# Altium schematic sheet 单片机最小系统.SchDoc
size A4
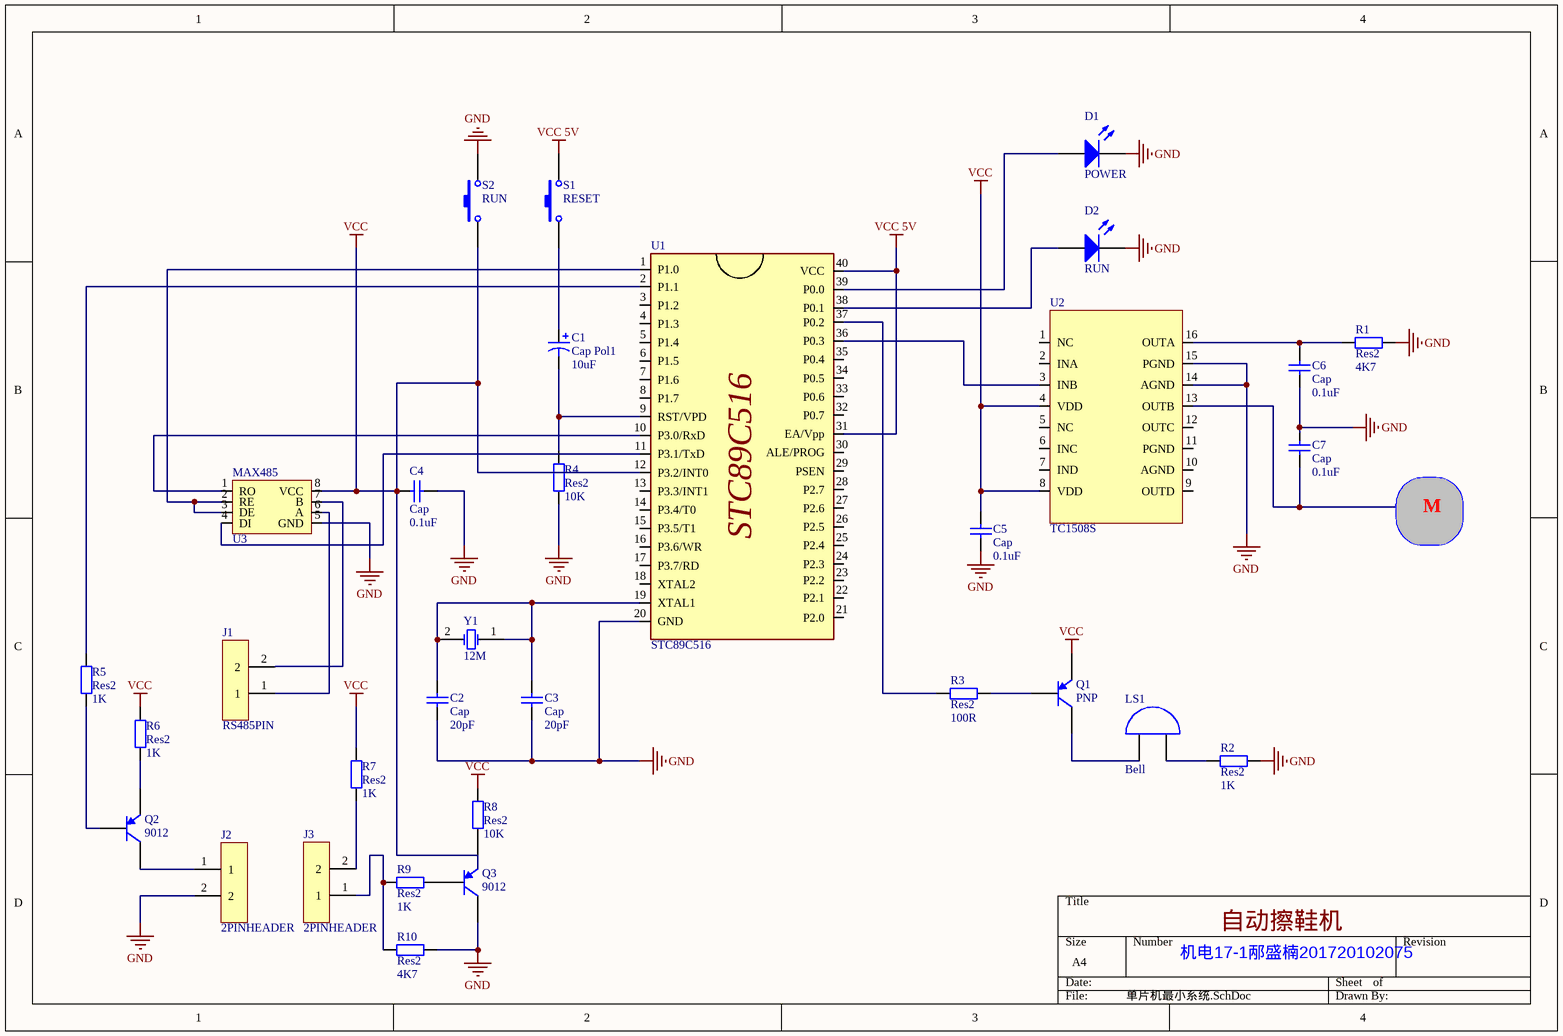
[diagram p0: 单片机最小系统.SchDoc]

## Parts
C1  Cap Pol1  value 10uF  [RB7.6-15]
C2  Cap  value 20pF  [RAD-0.3]
C3  Cap  value 20pF  [RAD-0.3]
C4  Cap  value 0.1uF  [RAD-0.3]
C5  Cap  value 0.1uF  [RAD-0.3]
C6  Cap  value 0.1uF  [RAD-0.3]
C7  Cap  value 0.1uF  [RAD-0.3]
D1  POWER  [LED-0]
D2  RUN  [LED-0]
J1  RS485PIN
J2  2PINHEADER
J3  2PINHEADER
LS1  Bell  [PIN2]
MAX485  U3  [MAX485]
Q1  PNP  [SOT-23B_N]
Q2  9012  [SOT-23B_N]
Q3  9012  [SOT-23B_L]
R1  Res2  value 4K7  [AXIAL-0.4]
R2  Res2  value 1K  [AXIAL-0.4]
R3  Res2  value 100R  [AXIAL-0.4]
R4  Res2  value 10K  [AXIAL-0.4]
R5  Res2  value 1K  [AXIAL-0.4]
R6  Res2  value 1K  [AXIAL-0.4]
R7  Res2  value 1K  [AXIAL-0.4]
R8  Res2  value 10K  [AXIAL-0.4]
R9  Res2  value 1K  [AXIAL-0.4]
R10  Res2  value 4K7  [AXIAL-0.4]
S1  RESET  [SPST-2]
S2  RUN  [SPST-2]
U1  STC89C516  [STC89C516]
U2  TC1508S  [TC1508S]
Y1  12M  [R38]

## Nets
GND: C2.1 C3.1 C4.2 C5.1 C6.1 C7.2 D1.2(K) D2.2(K) J2.2 MAX485.5(GND) Q3.1(C) R1.2 R2.2 R4.1 R10.2 S2.2 U1.20(GND) U2.14(AGND) U2.15(PGND)
VCC: C4.1 C5.2 MAX485.8(VCC) Q1.3(E) R6.2 R7.2 R8.2 S2.1 U1.12(P3.2/INT0) U2.4(VDD) U2.8(VDD)
VCC 5V: S1.2 U1.31(EA/Vpp) U1.40(VCC)
NetC1_1: C1.1 S1.1
NetC1_2: C1.2 R4.2 U1.9(RST/VPD)
NetC2_2: C2.2 C3.2 U1.19(XTAL1) Y1.1(OSC1) Y1.2(OSC2)
NetC6_2: C6.2 R1.1 U2.16(OUTA)
NetC7_1: C7.1 U2.13(OUTB)
NetD1_1: D1.1(A) U1.39(P0.0)
NetD2_1: D2.1(A) U1.38(P0.1)
NetJ1_1: J1.1 MAX485.6(A)
NetJ1_2: J1.2 MAX485.7(B)
NetJ2_1: J2.1 Q2.1(C)
NetJ3_1: J3.1 R9.1 R10.1
NetJ3_2: J3.2 R7.1
NetLS1_1: LS1.1(A) Q1.1(C)
NetLS1_2: LS1.2(B) R2.1
NetMAX485_1: MAX485.1(RO) U1.10(P3.0/RxD)
NetMAX485_2: MAX485.2(RE) MAX485.3(DE) U1.1(P1.0)
NetMAX485_4: MAX485.4(DI) U1.11(P3.1/TxD)
NetQ1_2: Q1.2(B) R3.2
NetQ2_2: Q2.2(B) R5.1
NetQ2_3: Q2.3(E) R6.1
NetQ3_2: Q3.2(B) R9.2
NetQ3_3: Q3.3(E) R8.1
NetR3_1: R3.1 U1.37(P0.2)
NetR5_2: R5.2 U1.2(P1.1)
NetU1_36: U1.36(P0.3) U2.3(INB)

Not connected (* = marked no-connect by the designer): U1 3(P1.2) 4(P1.3) 5(P1.4) 6(P1.5) 7(P1.6) 8(P1.7) 13(P3.3/INT1) 14(P3.4/T0) 15(P3.5/T1) 16(P3.6/WR) 17(P3.7/RD) 18(XTAL2) 21(P2.0) 22(P2.1) 23(P2.2) 24(P2.3) 25(P2.4) 26(P2.5) 27(P2.6) 28(P2.7) 29(PSEN) 30(ALE/PROG) 32(P0.7) 33(P0.6) 34(P0.5) 35(P0.4); U2 1(NC) 2(INA) 5(NC) 6(INC) 7(IND) 9(OUTD) 10(AGND) 11(PGND) 12(OUTC)

## Notes on the sheet
- M
- 机电17-1邴盛楠201720102075
- 自动擦鞋机

## Library data of the parts
C1 = Cap Pol1: Polarized Capacitor (Radial); Published: 8-Jun-2000; LatestRevisionDate: 17-Jul-2002; LatestRevisionNote: Re-released for DXP Platform.; PackageReference: RB7.6-15; Publisher: Altium Limited; PackageDescription: Polarized Capacitor (Radial); 2 Leads
C2-C7 = Cap: Capacitor; Published: 8-Jun-2000; LatestRevisionDate: 17-Jul-2002; LatestRevisionNote: Re-released for DXP Platform.; PackageReference: RAD-0.3; Publisher: Altium Limited; PackageDescription: Radial Cap, Thru-Hole; 2 Leads; 0.3 in Pin Spacing
D1 D2 = LED0: Typical INFRARED GaAs LED; Published: 8-Jun-2000; LatestRevisionDate: 08-Jul-2005; LatestRevisionNote: Mech Layer 1 removed.; PackageReference: LED-0; Publisher: Altium Limited; PackageDescription: LED; 2 Leads
J1-J3 MAX485 = Component_1
LS1 = Bell: Electrical Bell; Published: 24-Mar-1999; LatestRevisionDate: 17-Jul-2002; LatestRevisionNote: Re-released for DXP Platform.; PackageReference: PIN2; Publisher: Altium Limited
Q1-Q3 = PNP: PNP Bipolar Transistor; Published: 8-Jun-2000; LatestRevisionDate: 29-May-2009; LatestRevisionNote: IPC-7351 Footprint Added.; PackageVersion: Aug-1999; PackageReference: SOT-23B; Publisher: Altium Limited; PackageDescription: 3-Pin SOT-23 Package 0.95 mm Pitch, 2.4 mm Lead Span
R1-R10 = Res2: Resistor; Published: 8-Jun-2000; LatestRevisionDate: 17-Jul-2002; LatestRevisionNote: Re-released for DXP Platform.; PackageReference: AXIAL-0.4; Publisher: Altium Limited; PackageDescription: Axial Device, Thru-Hole; 2 Leads; 0.4 in Pin Spacing
S1 S2 = SW-PB: Switch; Published: 24-Mar-1999; LatestRevisionDate: 17-Jul-2002; LatestRevisionNote: Re-released for DXP Platform.; PackageReference: SPST-2; Publisher: Altium Limited; PackageDescription: Switch; 2 Leads
Y1 = XTAL: Crystal Oscillator; Published: 8-Jun-2000; LatestRevisionDate: 17-Jul-2002; LatestRevisionNote: Re-released for DXP Platform.; PackageReference: R38; Publisher: Altium Limited; PackageDescription: Crystal, Thru-Hole; 2 Leads; Body 3.1 x 8.2 mm (Dia.xH)